# Altium schematic sheet LVDS_Driver_Subsystem.SchDoc
size A; SheetNumber: 4; SheetTotal: 16
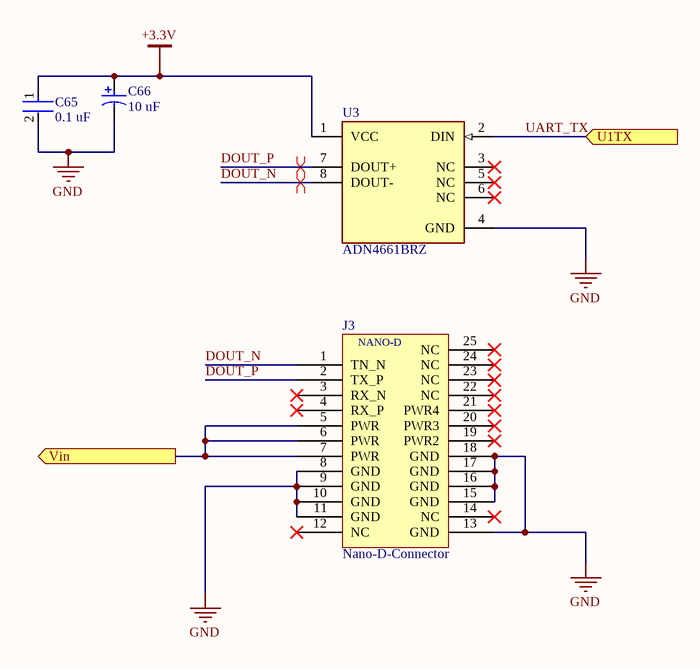
[diagram p0: LVDS_Driver_Subsystem.SchDoc]

## Parts
C65  0.1 uF  [FP-CC0603-DA-MFG]
C66  10 uF  [VISH-TR8-M_L]
J3  Nano-D-Connector  [A28400-025]
U3  ADN4661BRZ  [FP-R-8-IPC_A]

## Ports
U1TX (in), Vin (out)

## Nets
+3.3V: C65.1 C66.1 U3.1(VCC)
GND: C65.2 C66.2 J3.8(GND) J3.9(GND) J3.10(GND) J3.11(GND) J3.13(GND) J3.15(GND) J3.16(GND) J3.17(GND) J3.18(GND) U3.4(GND)
DOUT_N: J3.1(TN_N) U3.8(DOUT-)
DOUT_P: J3.2(TX_P) U3.7(DOUT+)
UART_TX: U3.2(DIN) ; port U1TX
Vin: J3.5(PWR) J3.6(PWR) J3.7(PWR) ; port Vin

Not connected (* = marked no-connect by the designer): J3 3(RX_N)* 4(RX_P)* 12(NC)* 14(NC)* 19(PWR2)* 20(PWR3)* 21(PWR4)* 22(NC)* 23(NC)* 24(NC)* 25(NC)*; U3 3(NC)* 5(NC)* 6(NC)*

## Layout directives
differential pair: DOUT_N, DOUT_P

## Notes on the sheet
- (in symbol Nano-D-Connector) NANO-D

## Library data of the parts
C65 = CMP-2000-05002-2: CAP CER 0.1UF 16V X7R 0603 CC0603KRX7R7BB104; Manufacturer: YAGEO; Tolerance: 0.1; Value: 100 nF; Temperature Coefficient: 15%; Material: Ceramic; Voltage Rating: 16 V; Package: CC0603-DA; ComponentLink2Description: Datasheet; Octopart: https://octopart.com/cc0603krx7r7bb104-yageo-192941; Temperature Range High: +125°C; Digikey Description: CAP CER 0.1UF 16V X7R 0603; Voltage: 16 V; Device Class L2: Capacitors; Height: 0.9mm; Temperature: -55°C to +125°C; Manufacturer Part Number: CC0603KRX7R7BB104; Device Class L1: Passive Components; Device Class L3: Ceramic Capacitors; ComponentLink2URL: http://www.yageo.com/documents/recent/UPY-GPHC_X7R_6.3V-to-50V_18.pdf; Footprint Url: http://www.yageo.com/exep/pages/download/literatures/UPY-C_GEN_24.pdf; RoHS: TRUE; Temperature Range Low: -55°C; Temperature Characteristic: X7R; Lead Free: Yes; Capacitance: 100 nF; Category: Cap; Mouser Description: Multilayer Ceramic Capacitor, CC Series, 0.1 - F, - 10%, X7R, 16 V, 0603 [1608 Metric]; Automotive: No
C66 = CMP-2000-07316-1: Tantalum Capacitor, 10 uF, +/- 20%, 10 V, -55 to 125 degC, 2-Pin SMD (M), RoHS, Tape and Reel TR8M106M010C2000; Manufacturer: Vishay; Capacitance: 10µF; Featured Product: TR8SeriesMoldedMicroTan™TantalumChipCapacitors; ESR (Equivalent Series Resistance): 2Ohm; Other Names: 718-1673-6; Catalog Drawings: TR8SeriesTR8SeriesBottom; Online Catalog: MICROTAN®TR8Series; Voltage - Rated: 10V; Type: Molded; Mounting Technology: SurfaceMount; Category: Capacitors; Lifetime @ Temp.: -; Package Reference: TR8-M; Size / Dimension: 0.063"Lx0.033"W(1.60mmx0.85mm); Operating Temperature: -55°C~125°C; Mounting Type: SurfaceMount; Lead Spacing: -; Tolerance: ±20%; Standard Package: 1; Datasheet URL: http://www.vishay.com/docs/40114/tr8.pdf; Package Description: 2-Pin Surface Mount Device, Body 1.6 x 0.85 mm; Height - Seated (Max): 0.035"(0.89mm); Family: TantalumCapacitors; Manufacturer Size Code: M; Series: MICROTAN®TR8; Packaging: Digi-Reel®; Manufacturer URL: http://www.vishay.com/; Datasheet Version: 03/2016; Package / Case: 0603(1608Metric); Features: GeneralPurpose
U3 = CMP-09093-000114-1: IC DRIVER 1/0 8SOIC; Supply Current: 7mA; Number of Receivers: 1; Min Supply Voltage: 3V; Max Supply Current: 10mA; Max Supply Voltage: 3.6V; Turn-On Delay Time: 1.5ns; Data Rate: 600Mbps; Operating Supply Voltage: 3.3V; Length: 5mm; Series: -; Number of Pins: 8; REACH SVHC: No SVHC; Mount: Surface Mount; RoHS Compliant: Yes; Packaging: Rail/Tube; Nominal Supply Current: 7mA; Radiation Hardening: No; Number of Drivers: 1; Width: 4mm; Number of Elements: 1; Lead Free: Contains Lead; Operating Supply Current: 7mA; Min Operating Temperature: -40°C; Propagation Delay: 1.5ns; Package Quantity: 98; Height: 1.5mm; Case/Package: SOIC; Max Operating Temperature: 85°C